# Altium schematic sheet 12_LPDDR2-32_168_BGA134.SchDoc
size 420 x 297 mm
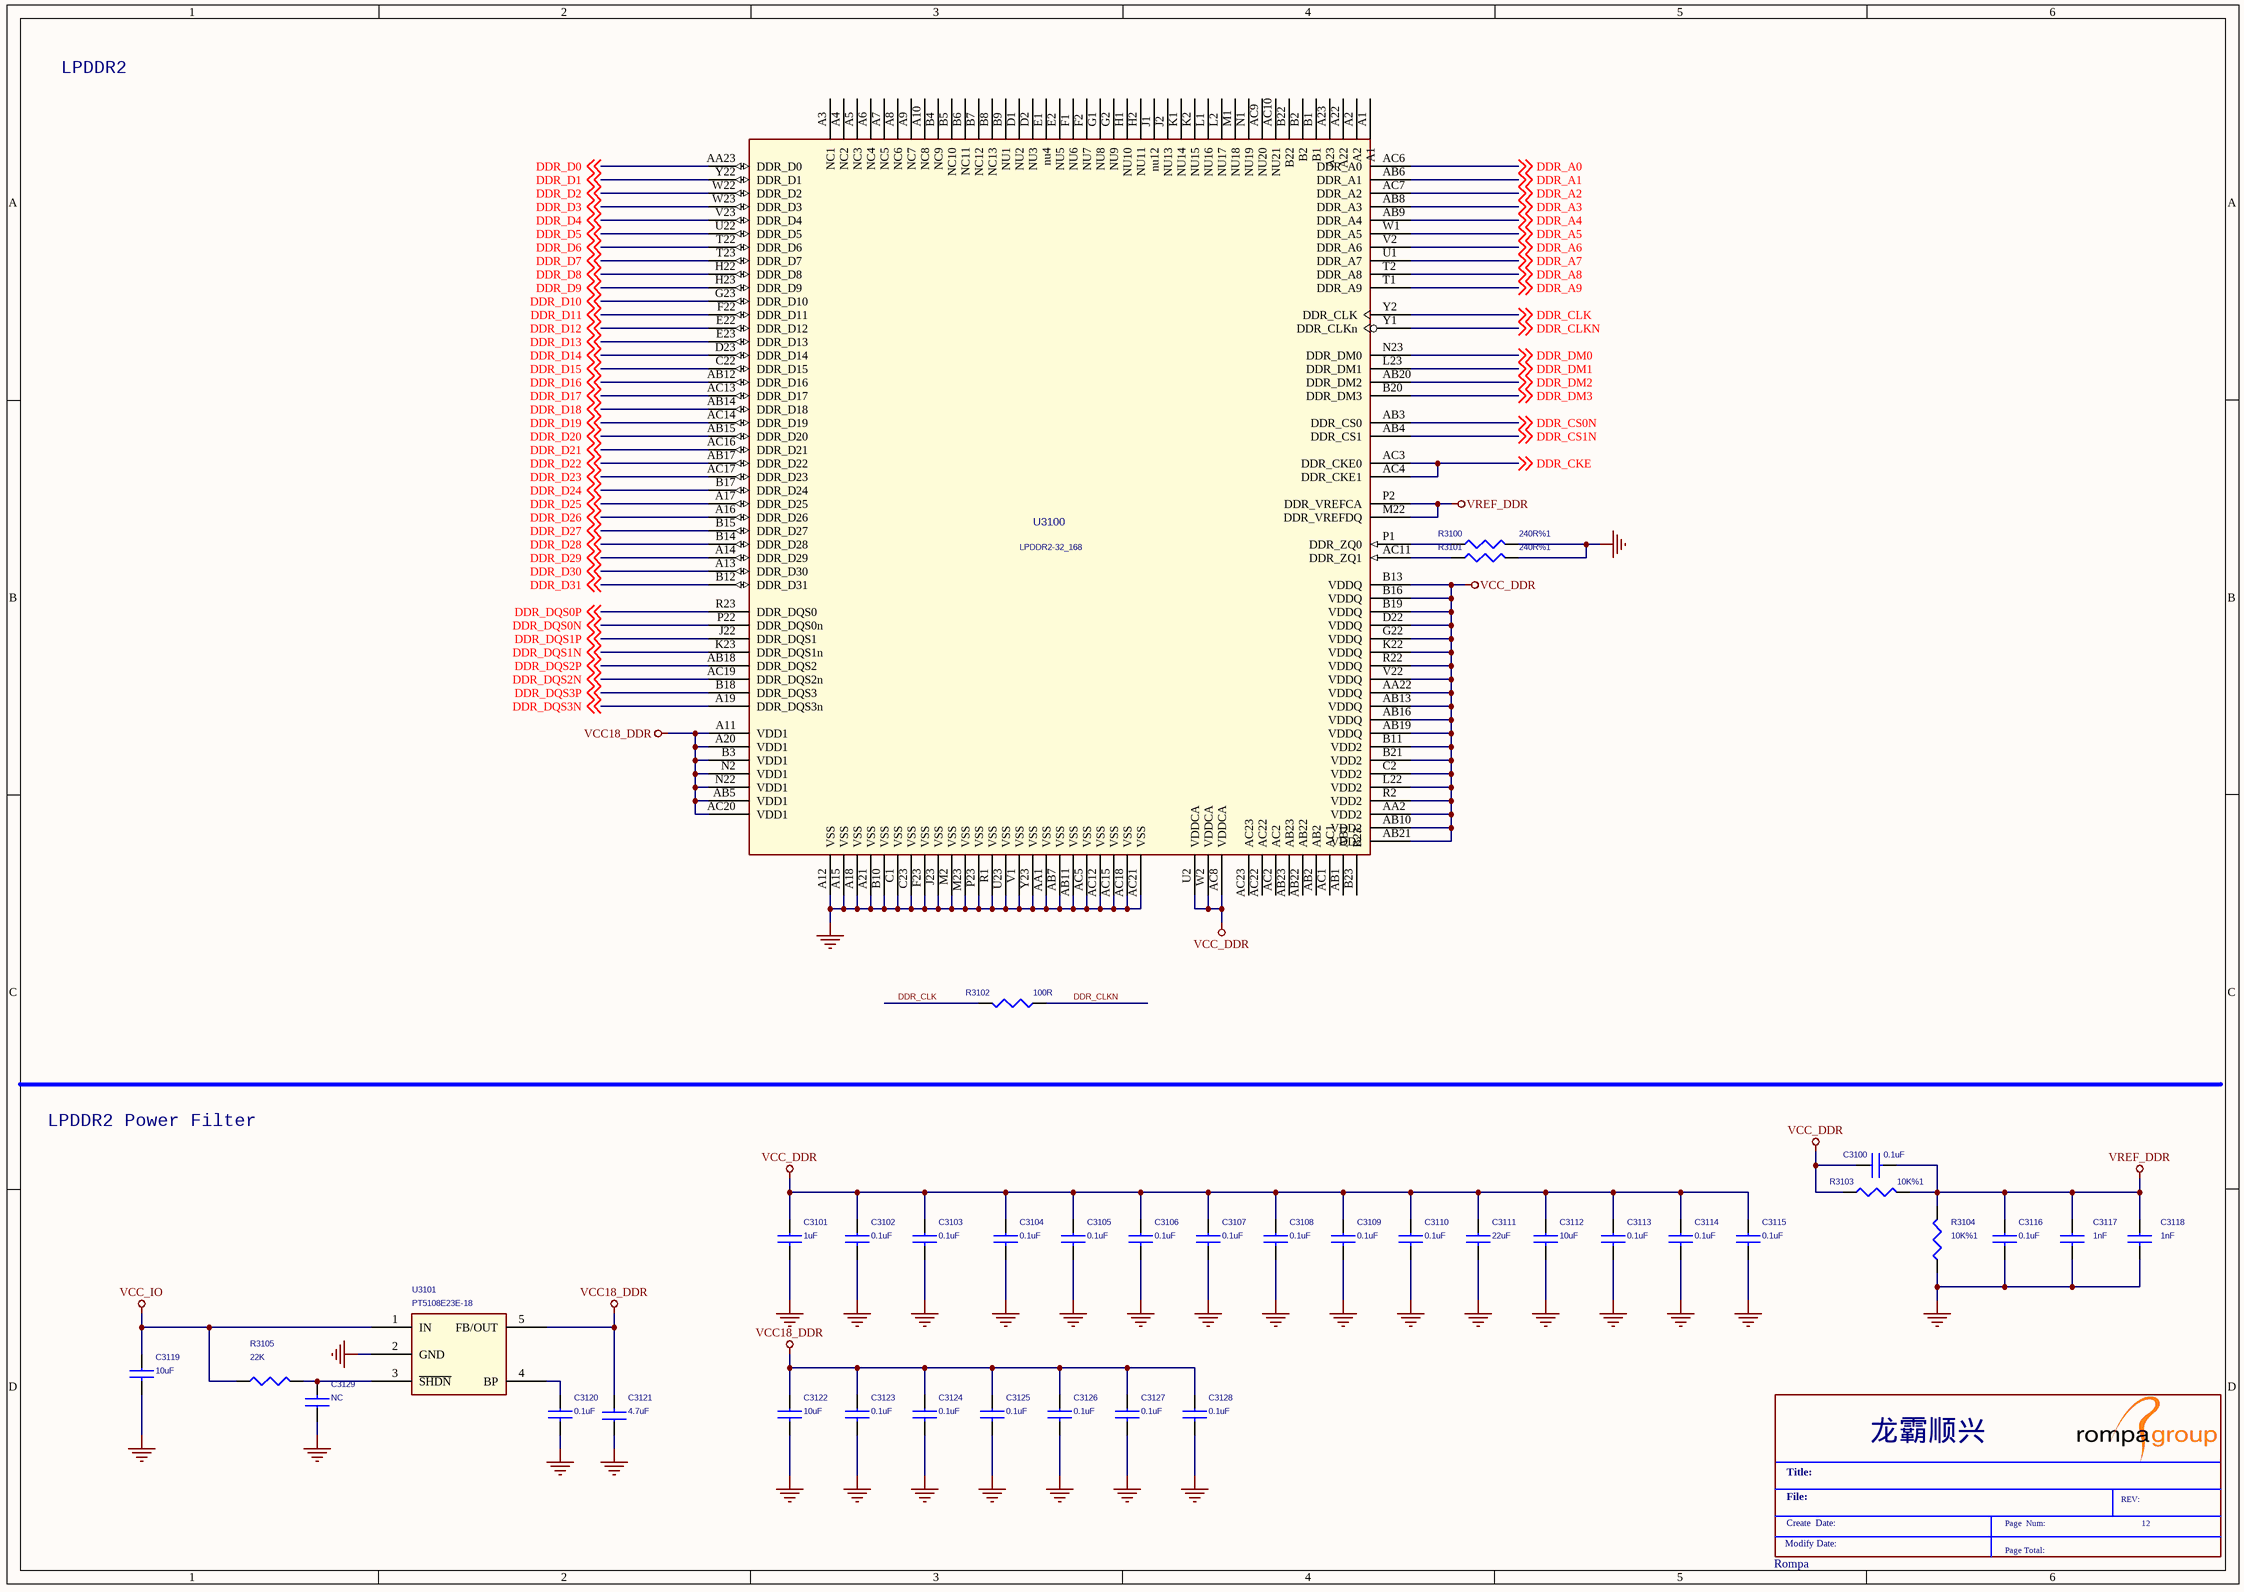
[diagram p0: 12_LPDDR2-32_168_BGA134.SchDoc]

## Parts
*  Rompa  Schematic Page Number: 12  (graphical)
C3100  0.1uF  [C0402]
C3101  1uF  [C0402]
C3102  0.1uF  [C0402]
C3103  0.1uF  [C0402]
C3104  0.1uF  [C0402]
C3105  0.1uF  [C0402]
C3106  0.1uF  [C0402]
C3107  0.1uF  [C0402]
C3108  0.1uF  [C0402]
C3109  0.1uF  [C0402]
C3110  0.1uF  [C0402]
C3111  22uF  [C0402]
C3112  10uF  [C0402]
C3113  0.1uF  [C0402]
C3114  0.1uF  [C0402]
C3115  0.1uF  [C0402]
C3116  0.1uF  [C0402]
C3117  1nF  [C0402]
C3118  1nF  [C0402]
C3119  10uF  [C0402]
C3120  0.1uF  [C0402]
C3121  4.7uF  [C0402]
C3122  10uF  [C0402]
C3123  0.1uF  [C0402]
C3124  0.1uF  [C0402]
C3125  0.1uF  [C0402]
C3126  0.1uF  [C0402]
C3127  0.1uF  [C0402]
C3128  0.1uF  [C0402]
C3129  NC  [C0402]
R3100  240R%1  [R0402]
R3101  240R%1  [R0402]
R3102  100R  [R0402]
R3103  10K%1  [R0402]
R3104  10K%1  [R0402]
R3105  22K  [R0402]
U3100  LPDDR2-32_168  [BGA134]
U3101  PT5108E23E-18  [SOT25]

## Nets
GND: C3101.2 C3102.2 C3103.2 C3104.2 C3105.2 C3106.2 C3107.2 C3108.2 C3109.2 C3110.2 C3111.2 C3112.2 C3113.2 C3114.2 C3115.2 C3116.2 C3117.2 C3118.2 C3119.2 C3120.2 C3121.1 C3122.2 C3123.2 C3124.2 C3125.2 C3126.2 C3127.2 C3128.2 C3129.1 R3100.2 R3101.2 R3104.1 U3100.A12(VSS) U3100.A15(VSS) U3100.A18(VSS) U3100.A21(VSS) U3100.AA1(VSS) U3100.AB7(VSS) U3100.AB11(VSS) U3100.AC5(VSS) U3100.AC12(VSS) U3100.AC15(VSS) U3100.AC18(VSS) U3100.AC21(VSS) U3100.B10(VSS) U3100.C1(VSS) U3100.C23(VSS) U3100.F23(VSS) U3100.J23(VSS) U3100.M2(VSS) U3100.M23(VSS) U3100.P23(VSS) U3100.R1(VSS) U3100.U23(VSS) U3100.V1(VSS) U3100.Y23(VSS) U3101.2(GND)
VCC18_DDR: C3121.2 C3122.1 C3123.1 C3124.1 C3125.1 C3126.1 C3127.1 C3128.1 U3100.A11(VDD1) U3100.A20(VDD1) U3100.AB5(VDD1) U3100.AC20(VDD1) U3100.B3(VDD1) U3100.N2(VDD1) U3100.N22(VDD1) U3101.5(FB/OUT)
VCC_DDR: C3100.1 C3101.1 C3102.1 C3103.1 C3104.1 C3105.1 C3106.1 C3107.1 C3108.1 C3109.1 C3110.1 C3111.1 C3112.1 C3113.1 C3114.1 C3115.1 R3103.1 U3100.AA2(VDD2) U3100.AA22(VDDQ) U3100.AB10(VDD2) U3100.AB13(VDDQ) U3100.AB16(VDDQ) U3100.AB19(VDDQ) U3100.AB21(VDD2) U3100.AC8(VDDCA) U3100.B11(VDD2) U3100.B13(VDDQ) U3100.B16(VDDQ) U3100.B19(VDDQ) U3100.B21(VDD2) U3100.C2(VDD2) U3100.D22(VDDQ) U3100.G22(VDDQ) U3100.K22(VDDQ) U3100.L22(VDD2) U3100.R2(VDD2) U3100.R22(VDDQ) U3100.U2(VDDCA) U3100.V22(VDDQ) U3100.W2(VDDCA)
VCC_IO: C3119.1 R3105.1 U3101.1(IN)
VREF_DDR: C3100.2 C3116.1 C3117.1 C3118.1 R3103.2 R3104.2 U3100.M22(DDR_VREFDQ) U3100.P2(DDR_VREFCA)
DDR_A0: U3100.AC6(DDR_A0) ; off-sheet DDR_A0
DDR_A1: U3100.AB6(DDR_A1) ; off-sheet DDR_A1
DDR_A2: U3100.AC7(DDR_A2) ; off-sheet DDR_A2
DDR_A3: U3100.AB8(DDR_A3) ; off-sheet DDR_A3
DDR_A4: U3100.AB9(DDR_A4) ; off-sheet DDR_A4
DDR_A5: U3100.W1(DDR_A5) ; off-sheet DDR_A5
DDR_A6: U3100.V2(DDR_A6) ; off-sheet DDR_A6
DDR_A7: U3100.U1(DDR_A7) ; off-sheet DDR_A7
DDR_A8: U3100.T2(DDR_A8) ; off-sheet DDR_A8
DDR_A9: U3100.T1(DDR_A9) ; off-sheet DDR_A9
DDR_CKE: U3100.AC3(DDR_CKE0) U3100.AC4(DDR_CKE1) ; off-sheet DDR_CKE
DDR_CLK: R3102.2 U3100.Y2(DDR_CLK) ; off-sheet DDR_CLK
DDR_CLKN: R3102.1 U3100.Y1(DDR_CLKn) ; off-sheet DDR_CLKN
DDR_CS0N: U3100.AB3(DDR_CS0) ; off-sheet DDR_CS0N
DDR_CS1N: U3100.AB4(DDR_CS1) ; off-sheet DDR_CS1N
DDR_D0: U3100.AA23(DDR_D0) ; off-sheet DDR_D0
DDR_D1: U3100.Y22(DDR_D1) ; off-sheet DDR_D1
DDR_D2: U3100.W22(DDR_D2) ; off-sheet DDR_D2
DDR_D3: U3100.W23(DDR_D3) ; off-sheet DDR_D3
DDR_D4: U3100.V23(DDR_D4) ; off-sheet DDR_D4
DDR_D5: U3100.U22(DDR_D5) ; off-sheet DDR_D5
DDR_D6: U3100.T22(DDR_D6) ; off-sheet DDR_D6
DDR_D7: U3100.T23(DDR_D7) ; off-sheet DDR_D7
DDR_D8: U3100.H22(DDR_D8) ; off-sheet DDR_D8
DDR_D9: U3100.H23(DDR_D9) ; off-sheet DDR_D9
DDR_D10: U3100.G23(DDR_D10) ; off-sheet DDR_D10
DDR_D11: U3100.F22(DDR_D11) ; off-sheet DDR_D11
DDR_D12: U3100.E22(DDR_D12) ; off-sheet DDR_D12
DDR_D13: U3100.E23(DDR_D13) ; off-sheet DDR_D13
DDR_D14: U3100.D23(DDR_D14) ; off-sheet DDR_D14
DDR_D15: U3100.C22(DDR_D15) ; off-sheet DDR_D15
DDR_D16: U3100.AB12(DDR_D16) ; off-sheet DDR_D16
DDR_D17: U3100.AC13(DDR_D17) ; off-sheet DDR_D17
DDR_D18: U3100.AB14(DDR_D18) ; off-sheet DDR_D18
DDR_D19: U3100.AC14(DDR_D19) ; off-sheet DDR_D19
DDR_D20: U3100.AB15(DDR_D20) ; off-sheet DDR_D20
DDR_D21: U3100.AC16(DDR_D21) ; off-sheet DDR_D21
DDR_D22: U3100.AB17(DDR_D22) ; off-sheet DDR_D22
DDR_D23: U3100.AC17(DDR_D23) ; off-sheet DDR_D23
DDR_D24: U3100.B17(DDR_D24) ; off-sheet DDR_D24
DDR_D25: U3100.A17(DDR_D25) ; off-sheet DDR_D25
DDR_D26: U3100.A16(DDR_D26) ; off-sheet DDR_D26
DDR_D27: U3100.B15(DDR_D27) ; off-sheet DDR_D27
DDR_D28: U3100.B14(DDR_D28) ; off-sheet DDR_D28
DDR_D29: U3100.A14(DDR_D29) ; off-sheet DDR_D29
DDR_D30: U3100.A13(DDR_D30) ; off-sheet DDR_D30
DDR_D31: U3100.B12(DDR_D31) ; off-sheet DDR_D31
DDR_DM0: U3100.N23(DDR_DM0) ; off-sheet DDR_DM0
DDR_DM1: U3100.L23(DDR_DM1) ; off-sheet DDR_DM1
DDR_DM2: U3100.AB20(DDR_DM2) ; off-sheet DDR_DM2
DDR_DM3: U3100.B20(DDR_DM3) ; off-sheet DDR_DM3
DDR_DQS0N: U3100.P22(DDR_DQS0n) ; off-sheet DDR_DQS0N
DDR_DQS0P: U3100.R23(DDR_DQS0) ; off-sheet DDR_DQS0P
DDR_DQS1N: U3100.K23(DDR_DQS1n) ; off-sheet DDR_DQS1N
DDR_DQS1P: U3100.J22(DDR_DQS1) ; off-sheet DDR_DQS1P
DDR_DQS2N: U3100.AC19(DDR_DQS2n) ; off-sheet DDR_DQS2N
DDR_DQS2P: U3100.AB18(DDR_DQS2) ; off-sheet DDR_DQS2P
DDR_DQS3N: U3100.A19(DDR_DQS3n) ; off-sheet DDR_DQS3N
DDR_DQS3P: U3100.B18(DDR_DQS3) ; off-sheet DDR_DQS3P
NetC3120_1: C3120.1 U3101.4(BP)
NetC3129_2: C3129.2 R3105.2 U3101.3(~{SHDN})
NetR3100_1: R3100.1 U3100.P1(DDR_ZQ0)
NetR3101_1: R3101.1 U3100.AC11(DDR_ZQ1)

Not connected (* = marked no-connect by the designer): U3100 A1 A2 A3(NC1) A4(NC2) A5(NC3) A6(NC4) A7(NC5) A8(NC6) A9(NC7) A10(NC8) A22 A23 AB1 AB2 AB22 AB23 AC1 AC2 AC9(NU20) AC10(NU21) AC22 AC23 B1 B2 B4(NC9) B5(NC10) B6(NC11) B7(NC12) B8(NC13) B9(NU1) B22 B23 D1(NU2) D2(NU3) E1(nu4) E2(NU5) F1(NU6) F2(NU7) G1(NU8) G2(NU9) H1(NU10) H2(NU11) J1(nu12) J2(NU13) K1(NU14) K2(NU15) L1(NU16) L2(NU17) M1(NU18) N1(NU19)

## Notes on the sheet
- LPDDR2
- LPDDR2 Power Filter
- (in symbol Rompa) 龙霸顺兴; Title:; File:; REV:; Create  Date:; Page  Num:; Modify Date:; Page Total:

## Library data of the parts
C3100 C3116-C3118 = CAP NP_0
C3101 C3102 C3122 = CAP NP: RoHS CHIP CAP 1uF +10/-10% X5R
C3103-C3115 C3123-C3128 = CAP NP: RoHS CHIP CAP 0.1uF +10/-10% X7R
C3119 = CAP NP: CAP,MLCC,22uF,+/-10%,X5R,6.3V,SMD1206
C3120 = CAP NP: CAP,MLCC,100nF,+/-10%,X7R,6.3V,SMD0402
C3121 = CAP NP: CAP,MLCC,10uF,+/-10%,X5R,6.3V,SMD0805
C3129 = CAP NP
R3100 R3101 R3103 R3104 = RESISTOR_0: 贴片电阻
R3102 = RESISTOR: NC/ROHS CHIP RES 100R 1/16W 5%
R3105 = RES 1B
U3100 = LPDDR2-32_2
U3101 = DS8008_4: LDO,PT5108E23E-18,VINmax=5.5V,Vout=1.8V,+/-2%,500mA,SOT-23-5